# EAGLE schematic Laird-BL652-v1.0.0 (EAGLE 7.7.0)
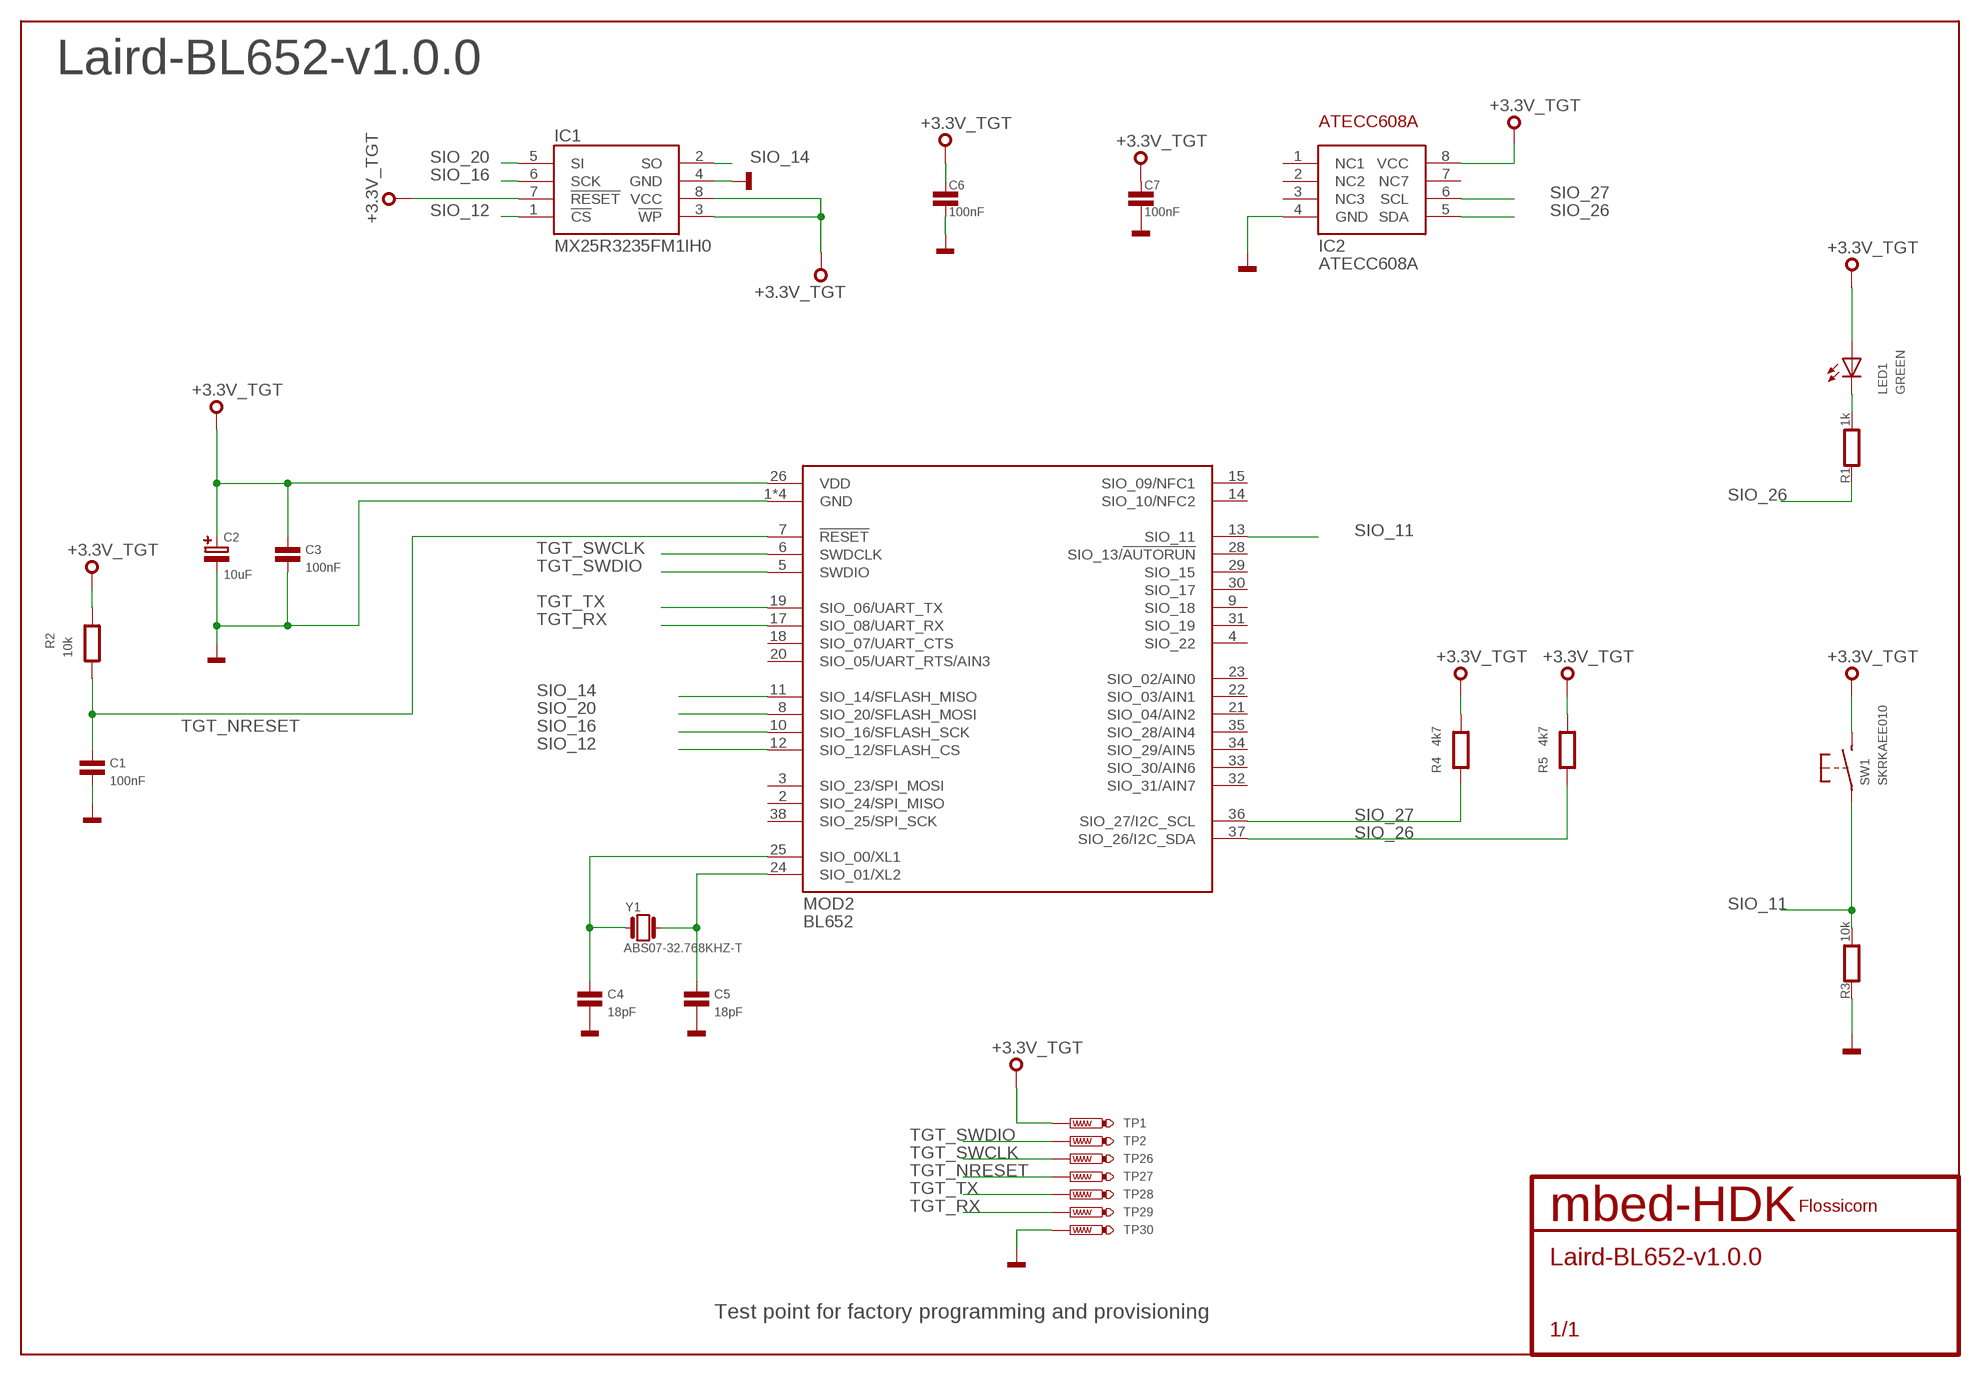
[diagram p0: schematic, sheet 1]

## Parts
C1  100nF  C0603  [0603]
C2  10uF  CAPACITOR-POLARISEDB  [SMC_B]
C3  100nF  C0603  [0603]
C4  18pF  C0603  [0603]
C5  18pF  C0603  [0603]
C6  100nF  CAPACITOR0603  [0603]
C7  100nF  CAPACITOR0603  [0603]
IC1  MX25R3235FM1IH0  [SO8]
IC2  ATECC608A  [SO8]
LED1  GREEN  SMD_LED0603  [CHIPLED_0603]
MOD2  BL652  [BL652]
R1  1k  RESISTOR0603  [0603]
R2  10k  RESISTOR0603  [0603]
R3  10k  RESISTOR0603  [0603]
R4  4k7  RESISTOR0603  [0603]
R5  4k7  RESISTOR0603  [0603]
SS1  FLOSSICORN0.25  [FLOSSICORN-0.25]
SW1  SKRKAEE010  [SKRKAEE010]
TP1  TEST_POINT-50R-SMD  [TP50-SMD]
TP2  TEST_POINT-50R-SMD  [TP50-SMD]
TP26  TEST_POINT-50R-SMD  [TP50-SMD]
TP27  TEST_POINT-50R-SMD  [TP50-SMD]
TP28  TEST_POINT-50R-SMD  [TP50-SMD]
TP29  TEST_POINT-50R-SMD  [TP50-SMD]
TP30  TEST_POINT-50R-SMD  [TP50-SMD]
Y1  ABS07-32.768KHZ-T  [FC135]

## Nets
+3.3V_TGT: C2.+ C3.1 C6.1 C7.1 IC1.3(!WP) IC1.7(!RESET) IC1.8(VCC) IC2.8(VCC) LED1.A MOD2.26(VDD) R2.2 R4.2 R5.2 SW1.P$2(S) TP1.TP
GND: C1.2 C2.- C3.2 C4.2 C5.2 C6.2 C7.2 IC1.4(GND) IC2.4(GND) MOD2.1(GND) MOD2.16(GND) MOD2.27(GND) MOD2.39(GND) R3.1 TP30.TP
N$2: C5.1 MOD2.24(SIO_01/XL2) Y1.X2
N$3: C4.1 MOD2.25(SIO_00/XL1) Y1.X1
PA_1: LED1.C R1.2
SIO_11: MOD2.13(SIO_11) R3.2 SW1.P$1(P)
SIO_12: IC1.1(!CS) MOD2.12(SIO_12/SFLASH_CS)
SIO_14: IC1.2(SO) MOD2.11(SIO_14/SFLASH_MISO)
SIO_16: IC1.6(SCK) MOD2.10(SIO_16/SFLASH_SCK)
SIO_20: IC1.5(SI) MOD2.8(SIO_20/SFLASH_MOSI)
SIO_26: IC2.5(SDA) MOD2.37(SIO_26/I2C_SDA) R1.1 R5.1
SIO_27: IC2.6(SCL) MOD2.36(SIO_27/I2C_SCL) R4.1
TGT_NRESET: C1.1 MOD2.7(!RESET) R2.1 TP27.TP
TGT_RX: MOD2.17(SIO_08/UART_RX) TP29.TP
TGT_SWCLK: MOD2.6(SWDCLK) TP26.TP
TGT_SWDIO: MOD2.5(SWDIO) TP2.TP
TGT_TX: MOD2.19(SIO_06/UART_TX) TP28.TP
Unconnected: IC2.1(NC1) IC2.2(NC2) IC2.3(NC3) IC2.7(NC7) MOD2.2(SIO_24/SPI_MISO) MOD2.3(SIO_23/SPI_MOSI) MOD2.4(SIO_22) MOD2.9(SIO_18) MOD2.14(SIO_10/NFC2) MOD2.15(SIO_09/NFC1) MOD2.18(SIO_07/UART_CTS) MOD2.20(SIO_05/UART_RTS/AIN3) MOD2.21(SIO_04/AIN2) MOD2.22(SIO_03/AIN1) MOD2.23(SIO_02/AIN0) MOD2.28(SIO_13/!AUTORUN) MOD2.29(SIO_15) MOD2.30(SIO_17) MOD2.31(SIO_19) MOD2.32(SIO_31/AIN7) MOD2.33(SIO_30/AIN6) MOD2.34(SIO_29/AIN5) MOD2.35(SIO_28/AIN4) MOD2.38(SIO_25/SPI_SCK)

## Notes on the sheet
- Laird-BL652-v1.0.0
- Test point for factory programming and provisioning

## Library data of the parts
C1 C3-C5 = mbed-HDK-RLC:C: Capacitor
C2 = mbed-HDK-RLC:CAPACITOR-POLARISED: Polarised capacitor; MF: Kemet; MFN: T491B106K020AT; OC-DIGIKEY: 399-8298-1-ND; OC-MOUSER: 80-T491B106K020; OC-NEWARK: 57K1740
C6 C7 = mbed-HDK-RLC:CAPACITOR: Capacitor
IC1 = mbed-HDK-IC:MX25R3235FM1IH0: Serial Flash 32 Mb 80 Mhz; MF: Macronix; MFN: MX25R3235FM1IH0; OC-DIGIKEY: 1092-1175-ND
IC2 = mbed-HDK-MF-ATMEL:ATECC608A: I2C Secure element and crytpo accelerator; MF: Atmel; MFN: ATECC608A; OC-DIGIKEY: ATECC608A-SSHCZ-TCT-ND; OC-MOUSER: 556-ATECC608ASSHDAB
LED1 = mbed-HDK-Optical:SMD_LED: LED SMD, Colour Red; MF: Wurth Electronics Inc; MFN: 150060RS75000; OC-DIGIKEY: 732-4978-1-ND; OC-MOUSER: 710-150060RS75000; OC-NEWARK: 2322071
MOD2 = mbed-HDK-MF-LAIRD:BL652: nRF52 Based BLE module; MF: Laird; MFN: BL652; OC-MOUSER: 239-BL652-SA-01; OC-NEWARK: 2664536
R1-R5 = mbed-HDK-RLC:RESISTOR: Resistor
SS1 = blackbriar:FLOSSICORN
SW1 = mbed-HDK-Switch:SKRKAEE010: MOMENTARY SWITCH PUSH VERTICAL (SPST); MF: ALPS; MFN: SKRKAEE010; OC-MOUSER: 688-SKRKAE
TP1 TP2 TP26-TP30 = mbed-HDK-Test:TEST_POINT
Y1 = mbed-HDK-Oscillator:ABS07-32.768KHZ-T: Crystal, Abracon 32.768kHz ±20ppm 12.5pF; MF: Abracon; MFN: ABS07-32.768KHZ-T; OC-DIGIKEY: 535-9542-1-ND; OC-MOUSER: 535-9542-1-ND; OC-NEWARK: 2101347